# EAGLE design ACESAVR328PISPBoBV3 (EAGLE 9.4.2)
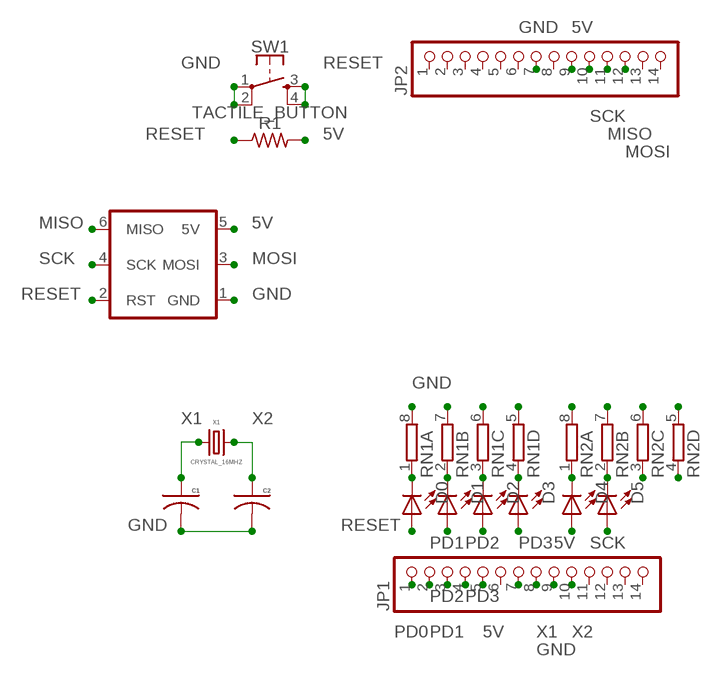
[diagram p0: schematic, sheet 1]

## Parts
C1  C-USC0603K  [C0603K]
C2  C-USC0603K  [C0603K]
D0  BLUE  LEDCHIP-LED0603  [CHIP-LED0603]
D1  BLUE  LEDCHIP-LED0603  [CHIP-LED0603]
D2  BLUE  LEDCHIP-LED0603  [CHIP-LED0603]
D3  BLUE  LEDCHIP-LED0603  [CHIP-LED0603]
D4  RED  LEDCHIP-LED0603  [CHIP-LED0603]
D5  GREEN  LEDCHIP-LED0603  [CHIP-LED0603]
H1  ISP_HEADER  [ICSP]
JP1  PINHD-1X14  [1X14]
JP2  PINHD-1X14  [1X14]
R1  R-US_R0603  [R0603]
RN1  4R-N0603-ARC  [0603-ARC]
RN2  4R-N0603-ARC  [0603-ARC]
SW1  TACTILE_BUTTON  [TACTILE_BUTTON_SMD_5.2MM]
X1  CRYSTAL_16MHZ  [HC49US]

## Nets
5V: D4.A H1.5(5V) JP1.7 JP2.9 R1.2
GND: C1.2 C2.2 H1.1(GND) JP1.8 JP2.7 RN1.5 RN1.6 RN1.7 RN1.8 RN2.5 RN2.6 RN2.7 RN2.8 SW1.1 SW1.2
MISO: H1.6(MISO) JP2.11
MOSI: H1.3(MOSI) JP2.12
N$1: D0.C RN1.1
N$2: D1.C RN1.2
N$3: D2.C RN1.3
N$4: D3.C RN1.4
N$5: D4.C RN2.1
N$6: D5.C RN2.2
N$7: RN2.3
N$8: RN2.4
PD0: D0.A JP1.2
PD1: D1.A JP1.3
PD2: D2.A JP1.4
PD3: D3.A JP1.5
RESET: H1.2(RST) JP1.1 R1.1 SW1.3 SW1.4
SCK: D5.A H1.4(SCK) JP2.10
X1: C1.1 JP1.9 X1.1
X2: C2.1 JP1.10 X1.2
Unconnected: JP1.6 JP1.11 JP1.12 JP1.13 JP1.14 JP2.1 JP2.2 JP2.3 JP2.4 JP2.5 JP2.6 JP2.8 JP2.13 JP2.14

## Library data of the parts
C1 C2 = rcl:C-US: CAPACITOR, American symbol; SPICEPREFIX: C
D0 D1-D5 = adafruit:LED: LED OSRAM: - CHIPLED LG R971, LG N971, LY N971, LG Q971, LY Q971, LO R971, LY R971 LH N974, LH R974 LS Q976, LO Q976, LY Q976 LO Q996 - Hyper CHIPLED LW Q18S LB Q993, LB Q99A, LB R99A - SideLED LS A670, LO A670, LY A670, LG A670, LP A670 LB A673, LV A673, LT A673, LW A673 LH A674 LY A675 LS A676, LA A676, LO A676, LY A676, LW A676 LS A679, LY A679, LG A679 - Hyper Micro SIDELED® LS Y876, LA Y876, LO Y876, LY Y876 LT Y87S - SmartLED LW L88C, LW L88S LB L89C, LB L89S, LG L890 LS L89K, LO L89K, LY L89K LS L896, LA L896, LO L896, LY L896 - TOPLED LS T670, LO T670, LY T670, LG T670, LP T670 LSG T670, LSP T670, LSY T670, LOP T670, LYG T670 LG T671, LOG T671, LSG T671 LB T673, LV T673, LT T673, LW T673 LH T674 LS T676, LA T676, LO T676, LY T676, LB T676, LH T676, LSB T676, LW T676 LB T67C, LV T67C, LT T67C, LS T67K, LO T67K, LY T67K, LW E67C LS E67B, LA E67B, LO E67B, LY E67B, LB E67C, LV E67C, LT E67C LW T67C LS T679, LY T679, LG T679 LS T770, LO T770, LY T770, LG T770, LP T770 LB T773, LV T773, LT T773, LW T773 LH T774 LS E675, LA E675, LY E675, LS T675 LS T776, LA T776, LO T776, LY T776, LB T776 LHGB T686 LT T68C, LB T68C - Hyper Mini TOPLED® LB M676 - Mini TOPLED Santana® LG M470 LS M47K, LO M47K, LY M47K Source: http://www.osram.convergy.de/
H1 = ACES_THT:ISP_HEADER: No more excuses for getting these lines crossed!
JP1 JP2 = pinhead:PINHD-1X14: PIN HEADER
R1 = resistor:R-US_: RESISTOR, American symbol
RN1 RN2 = resistor-dil:4R-N: Array Chip Resistor Source: RS Component / Phycomp; OC_FARNELL: unknown; OC_NEWARK: unknown
SW1 = ACES_SMT:TACTILE_BUTTON
X1 = ACES_THT:CRYSTAL_16MHZ

## Board
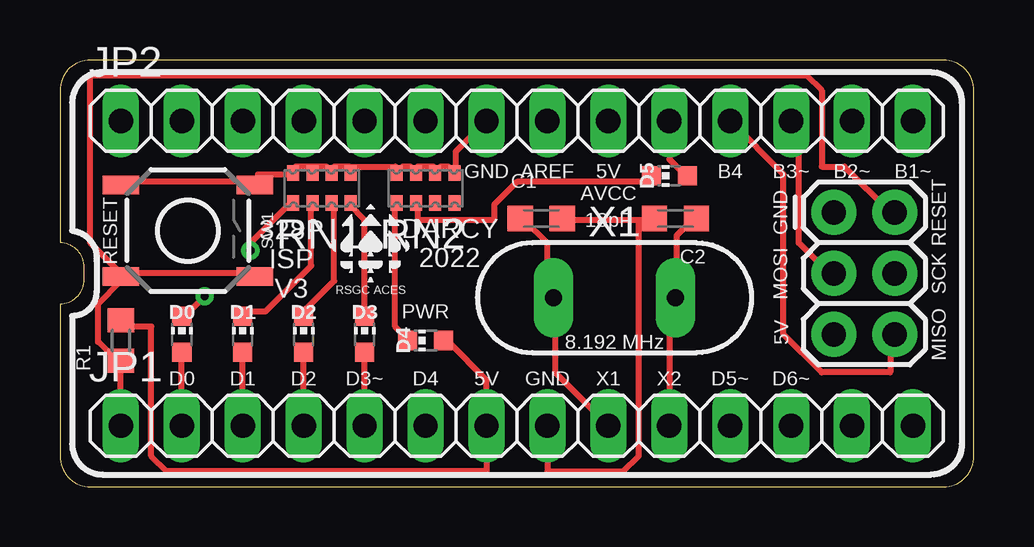
[diagram p1: board, top side]
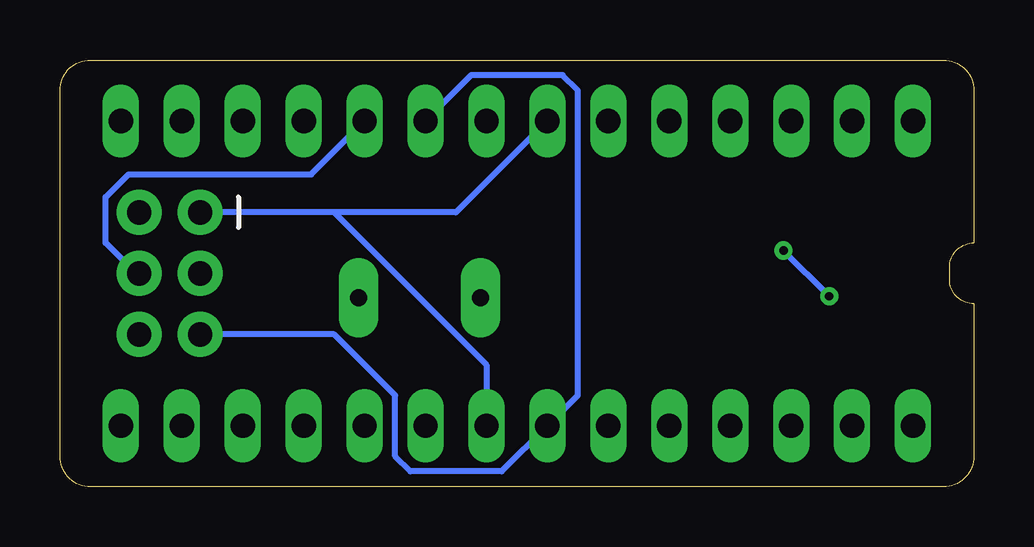
[diagram p2: board, bottom side, seen from below]

Size 38.1 x 17.78 mm. Coordinates in mm from the lower left corner, seen from the top.
Outline: 0,1.27 arc90 1.27,0 36.83,0 arc90 38.1,1.27 38.1,16.51 arc90 36.83,17.78 1.27,17.78 arc90 0,16.51 0,10.16 arc-90 1.02,9.14 1.02,8.64 arc-90 0,7.62 0,1.27
Copper layers (1*16): Top 0.035mm / dielectric 1.5mm / Bottom 0.035mm
Design rules "ACES_SMT": minimum track width 10mil, minimum drill 0.35mm, track to track 10mil, track to pad 10mil, pad to pad 9mil, via to via 10mil, smd to smd 8mil, copper to edge 10mil, drill to drill 8mil, minimum pad ring 10mil, minimum via ring 8mil, stop-mask expansion 4mil, vias tented up to drill 0mil, thermal gap 10mil

### Footprints (pad centres in the part's own frame; a part is rotated, then mirrored left to right if it is on the bottom)
C0603K = smd 1.05 x 1.08: 1 -0.875,0; 2 0.875,0
CHIP-LED0603 = smd 0.8 x 0.8: A 0,-0.75; C 0,0.75
ICSP = drill 1.016 pad 1.88: 1 0,0; 2 0,2.54; 3 2.54,0; 4 2.54,2.54; 5 5.08,0; 6 5.08,2.54
1X14 = drill 1.016 long: 1 -16.51,0; 2 -13.97,0; 3 -11.43,0; 4 -8.89,0; 5 -6.35,0; 6 -3.81,0; 7 -1.27,0; 8 1.27,0; 9 3.81,0; 10 6.35,0; 11 8.89,0; 12 11.43,0; 13 13.97,0; 14 16.51,0
R0603 = smd 1 x 1.1: 1 -0.85,0; 2 0.85,0
0603-ARC = smd 0.5 x 0.65: 1 -1.2,-0.625; 2 -0.4,-0.625; 3 0.4,-0.625; 4 1.2,-0.625; 5 1.2,0.625; 6 0.4,0.625; 7 -0.4,0.625; 8 -1.2,0.625
TACTILE_BUTTON_SMD_5.2MM = smd 0.762 x 1.524: 1 -1.905,-2.794; 2 -1.905,2.794; 3 1.905,-2.794; 4 1.905,2.794
HC49US = drill 0.7 pad 1.651 long: 1 -2.54,0; 2 2.54,0

### Placement (x,y rotation side)
C1  20.07,11.18 0 top
C2  25.65,11.18 180 top
D0  5.08,6.35 0 top
D1  7.62,6.35 0 top
D2  10.16,6.35 0 top
D3  12.7,6.35 0 top
D4  15.24,6.1 90 top
D5  25.4,12.95 90 top
H1  32.26,11.43 270 top
JP1  19.05,2.54 0 top
JP2  19.05,15.24 0 top
R1  2.54,6.1 90 top
RN1  10.92,12.45 0 top
RN2  15.24,12.45 0 top
SW1  5.33,10.67 270 top
U$1  [SMALL_TSILK_TEXT]  12.95,10.16 0 top
X1  23.11,7.87 0 top

### Tracks (layer width: path | path; a pad name or v marks a point on that pad's centre or on a via)
5V
  Top 0.254: D4.A 16.19,6.03 17.78,4.45 JP1.7 17.78,0.64 4.45,0.64 3.81,1.27 3.81,6.67 2.54,6.67 R1.2
  Bottom 0.254: JP2.9 20.95,17.14 17.14,17.14 16.51,16.51 16.51,3.81 JP1.7 19.68,0.64 23.5,0.64 24.13,1.27 24.13,3.81 26.67,6.35 H1.5
GND
  Top 0.254: 24.13,11.11 24.77,11.11 C2.2 | 24.13,11.11 20.95,11.11 C1.2 | 24.13,11.11 24.13,1.27 23.5,0.64 20.32,0.64 JP1.8 | 10.48,13.34 9.84,13.34 RN1.8 9.53,13.02 8.26,13.02 8.26,12.7 SW1.2 7.94,12.7 2.54,12.7 SW1.1 | 12.06,13.34 11.43,13.34 RN1.6 11.11,13.34 10.48,13.34 | 10.48,13.34 RN1.7 | 12.06,13.34 13.97,13.34 RN2.8 14.29,13.34 14.61,13.34 RN2.7 14.92,13.34 15.56,13.34 RN2.6 15.88,13.34 16.19,13.34 RN2.5 16.51,13.34 16.51,13.97 JP2.7 | 12.06,13.34 RN1.5
  Bottom 0.254: 26.67,11.43 21.59,11.43 JP2.7 | 26.67,11.43 H1.1 | JP1.8 20.32,5.08 26.67,11.43
MISO
  Top 0.254: JP2.11 30.16,13.02 30.16,6.35 31.75,4.76 34.61,4.76 34.61,6.35 H1.6
MOSI
  Top 0.254: JP2.12 30.8,14.92 30.8,10.16 32.07,8.89 H1.3
N$1  (via drill 0.35)
  Top 0.254: v7.94,9.84 7.94,10.16 9.53,11.75 RN1.1 | v6.03,7.94 5.08,6.99 D0.C
  Bottom 0.254: v6.03,7.94 v7.94,9.84
N$2
  Top 0.254: RN1.2 10.48,11.75 10.48,9.21 8.57,7.3 7.62,7.3 D1.C
N$3
  Top 0.254: RN1.3 11.43,11.75 11.43,8.57 10.16,7.3 D2.C
N$4
  Top 0.254: D3.C 12.7,11.11 12.06,11.75 RN1.4
N$5
  Top 0.254: RN2.1 13.97,11.75 13.97,6.67 14.29,6.35 D4.C
N$6
  Top 0.254: RN2.2 14.92,11.75 14.92,11.11 18.1,11.11 18.1,11.75 19.05,12.7 24.45,12.7 D5.C
PD0
  Top 0.254: JP1.2 D0.A
PD1
  Top 0.254: JP1.3 D1.A
PD2
  Top 0.254: JP1.4 D2.A
PD3
  Top 0.254: JP1.5 D3.A
RESET
  Top 0.254: 2.54,8.89 7.94,8.89 SW1.4 | JP1.1 2.54,5.08 | 2.54,5.08 1.59,6.03 1.59,7.62 2.54,8.57 SW1.3 2.54,8.89 | 2.54,5.08 R1.1 | 2.54,8.89 1.27,10.16 1.27,17.14 31.11,17.14 31.75,16.51 31.75,13.34 32.7,13.34 34.61,11.43 H1.2
SCK
  Top 0.254: JP2.10 25.4,13.65 26.04,13.02 D5.A
  Bottom 0.254: JP2.10 27.62,13.02 35.24,13.02 36.2,12.06 36.2,10.16 34.92,8.89 H1.4
X1
  Top 0.254: C1.1 19.37,11.11 20.32,10.16 20.32,7.94 X1.1 20.64,7.62 20.64,4.76 JP1.9
X2
  Top 0.254: C2.1 26.35,11.11 25.72,10.48 25.72,7.94 X1.2 25.4,7.62 JP1.10

### Text on the board
tSilk: GND | AREF | 5V / AVCC | B4 | B3~ | B2~ | B1~ | RESET | 18pF | GND | RESET | DARCY / 2022 | MOSI | SCK | 328P / ISP / V3 | PWR | 8.192 MHz | MISO | D0 | D1 | D2 | D3~ | D4 | 5V | GND | X1 | X2 | D5~ | D6~